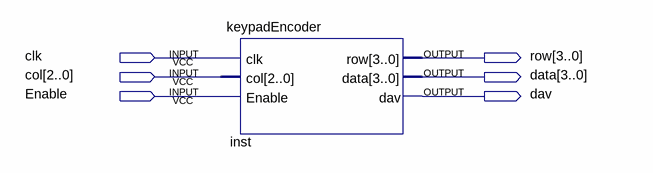
[diagram p0: schematic sheet]
// Quartus schematic testKeypadEncoder.bdf as structural Verilog: 1 symbols, 6 pins
module testKeypadEncoder (
  input  clk,
  input  [2:0] col,
  input  Enable,
  output [3:0] row,
  output [3:0] data,
  output dav
);

  keypadEncoder inst (.clk(clk), .col(col), .Enable(Enable), .row(row), .data(data), .dav(dav));
endmodule
